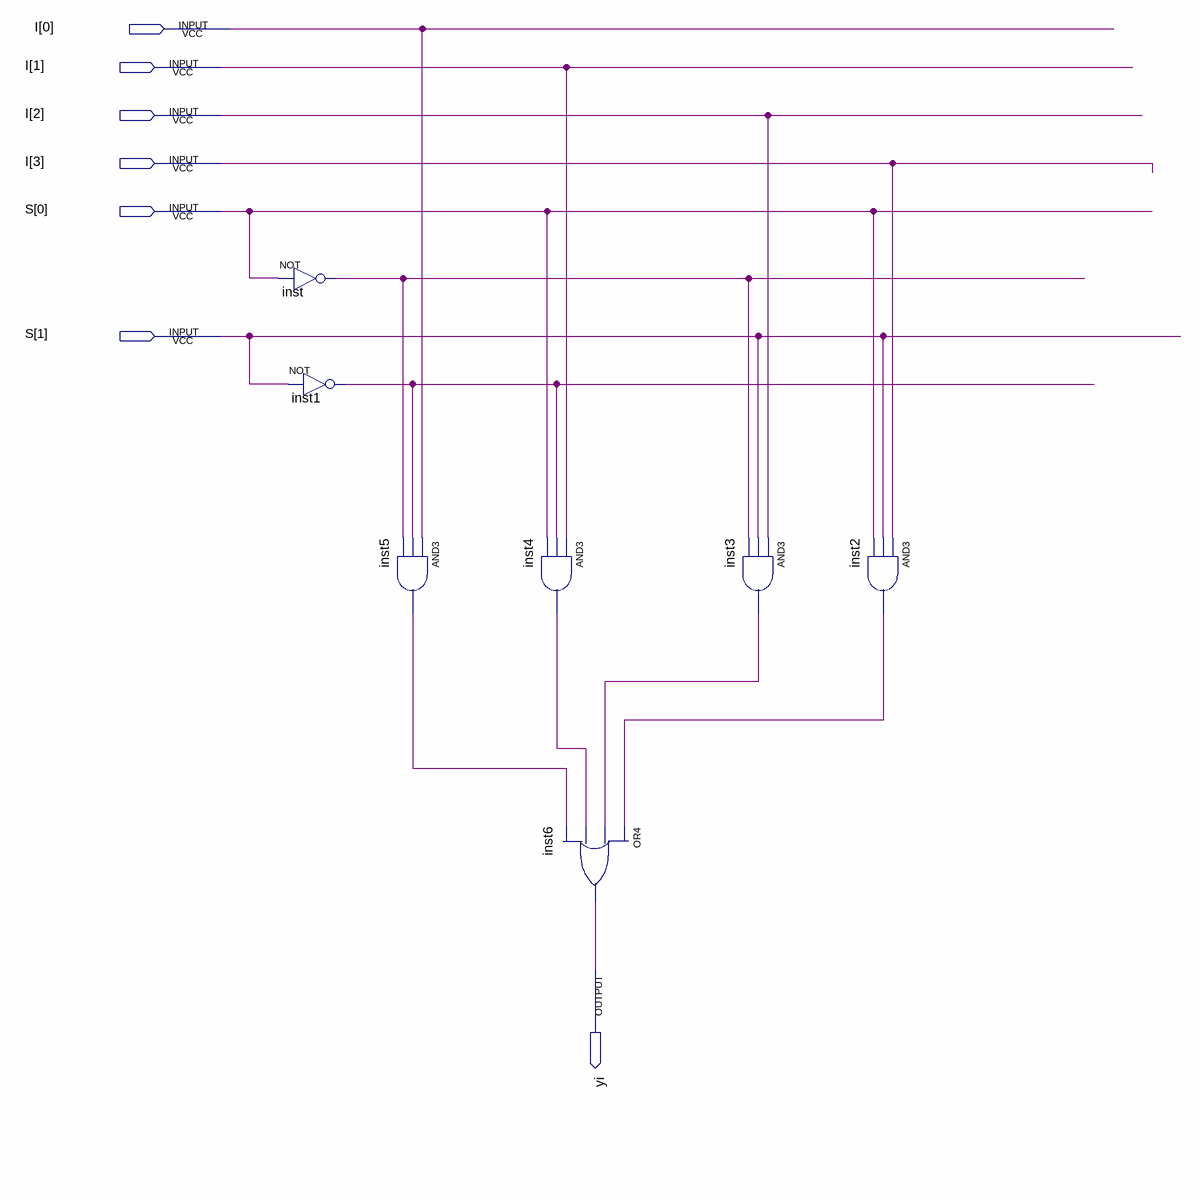
[diagram p0: schematic sheet]
// Quartus schematic mux4x1.bdf as structural Verilog: 7 symbols, 7 pins
module mux4x1 (
  input  [3:0] I,
  input  [1:0] S,
  output yi
);

  wire inst1_out, inst2_out, inst3_out, inst4_out, inst5_out, inst_out;

  not inst (inst_out, S[0]);
  not inst1 (inst1_out, S[1]);
  and inst5 (inst5_out, I[0], inst1_out, inst_out);
  and inst4 (inst4_out, I[1], inst1_out, S[0]);
  or inst6 (yi, inst2_out, inst3_out, inst4_out, inst5_out);
  and inst3 (inst3_out, I[2], S[1], inst_out);
  and inst2 (inst2_out, I[3], S[1], S[0]);
endmodule
